# Altium project S12642_0404_etap3.PrjPcb
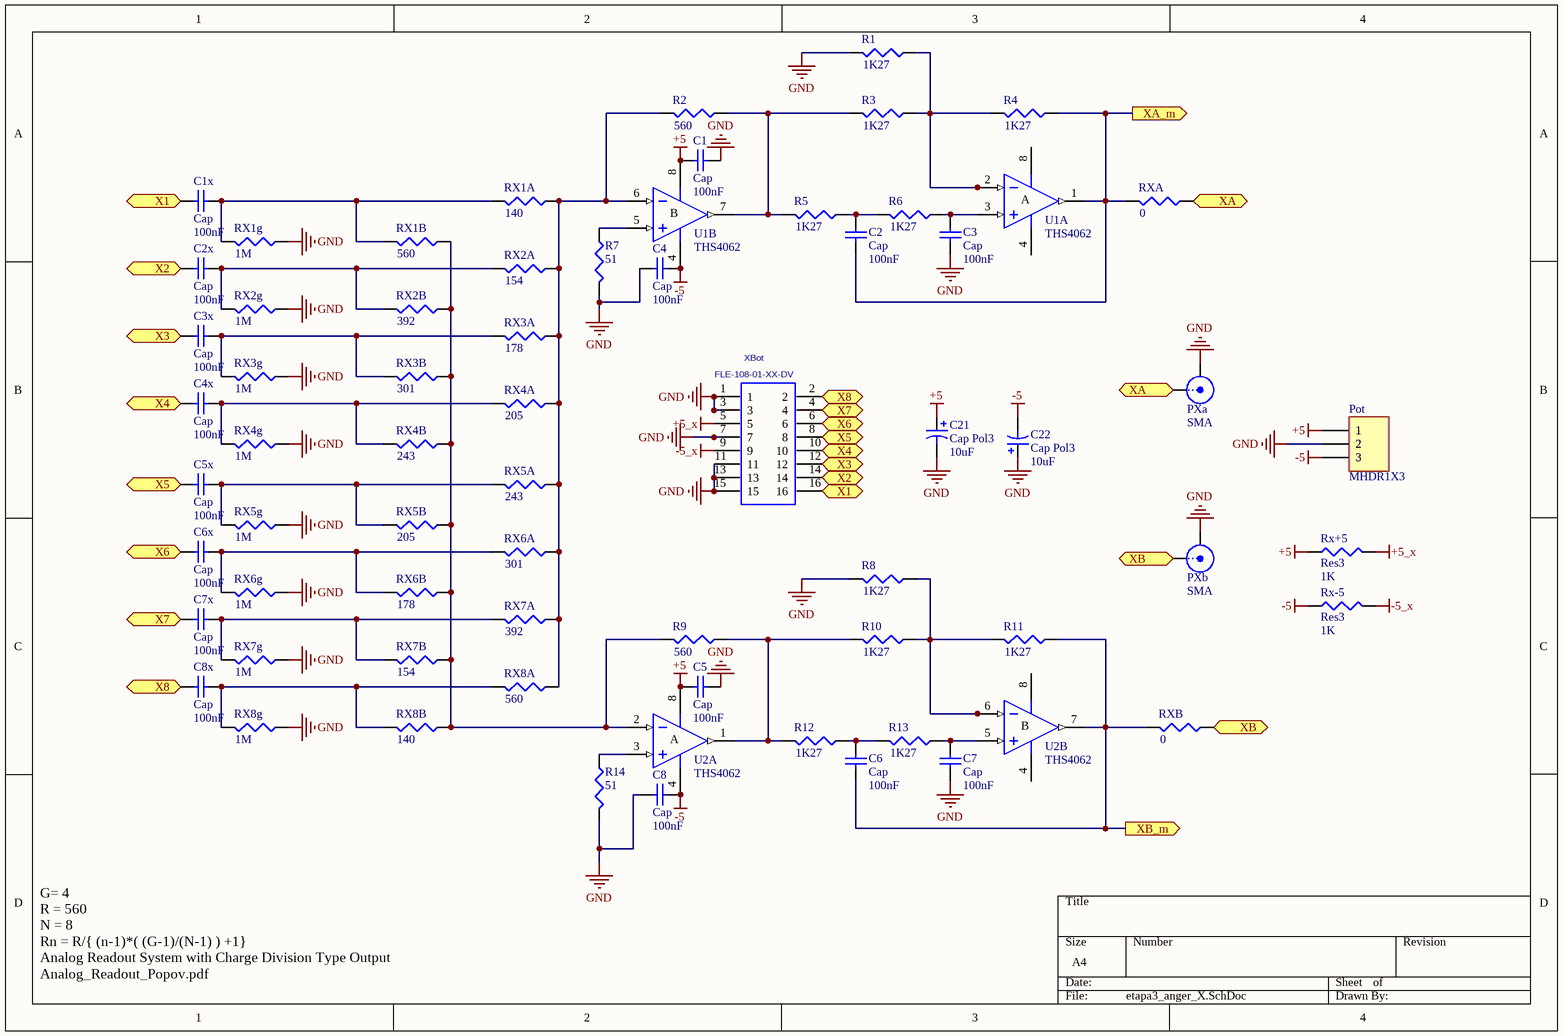
[diagram p0: etapa3_anger_X.SchDoc]
2 sheets, 129 parts. Net scope: flat (ports and power ports of the same name join across sheets).
Board file: etapa_3.PcbDoc
Sheets:
  etapa3_anger_X.SchDoc
  etapa3_anger_Y.SchDoc

## Sheet etapa3_anger_X.SchDoc
size A4

### Parts
C1  Cap  value 100nF  [0402]
C1x  Cap  value 100nF  [0402]
C2  Cap  value 100nF  [0402]
C2x  Cap  value 100nF  [0402]
C3  Cap  value 100nF  [0402]
C3x  Cap  value 100nF  [0402]
C4  Cap  value 100nF  [0402]
C4x  Cap  value 100nF  [0402]
C5  Cap  value 100nF  [0402]
C5x  Cap  value 100nF  [0402]
C6  Cap  value 100nF  [0402]
C6x  Cap  value 100nF  [0402]
C7  Cap  value 100nF  [0402]
C7x  Cap  value 100nF  [0402]
C8  Cap  value 100nF  [0402]
C8x  Cap  value 100nF  [0402]
C21  Cap Pol3  value 10uF  [1608[0603]]
C22  Cap Pol3  value 10uF  [1608[0603]]
Pot  MHDR1X3  [MHDR1X3]
PXa  SMA  [SMB_V-RJ45]
PXb  SMA  [SMB_V-RJ45]
R1  value 1K27  [0402]  (hidden comment: Res3)
R2  value 560  [0402]  (hidden comment: Res3)
R3  value 1K27  [0402]  (hidden comment: Res3)
R4  value 1K27  [0402]  (hidden comment: Res3)
R5  value 1K27  [0402]  (hidden comment: Res3)
R6  value 1K27  [0402]  (hidden comment: Res3)
R7  value 51  [0402]  (hidden comment: Res3)
R8  value 1K27  [0402]  (hidden comment: Res3)
R9  value 560  [0402]  (hidden comment: Res3)
R10  value 1K27  [0402]  (hidden comment: Res3)
R11  value 1K27  [0402]  (hidden comment: Res3)
R12  value 1K27  [0402]  (hidden comment: Res3)
R13  value 1K27  [0402]  (hidden comment: Res3)
R14  value 51  [0402]  (hidden comment: Res3)
RX1A  value 140  [0402]  (hidden comment: Res3)
RX1B  value 560  [0402]  (hidden comment: Res3)
RX1g  value 1M  [0402]  (hidden comment: Res3)
RX2A  value 154  [0402]  (hidden comment: Res3)
RX2B  value 392  [0402]  (hidden comment: Res3)
RX2g  value 1M  [0402]  (hidden comment: Res3)
RX3A  value 178  [0402]  (hidden comment: Res3)
RX3B  value 301  [0402]  (hidden comment: Res3)
RX3g  value 1M  [0402]  (hidden comment: Res3)
RX4A  value 205  [0402]  (hidden comment: Res3)
RX4B  value 243  [0402]  (hidden comment: Res3)
RX4g  value 1M  [0402]  (hidden comment: Res3)
RX5A  value 243  [0402]  (hidden comment: Res3)
RX5B  value 205  [0402]  (hidden comment: Res3)
RX5g  value 1M  [0402]  (hidden comment: Res3)
RX6A  value 301  [0402]  (hidden comment: Res3)
RX6B  value 178  [0402]  (hidden comment: Res3)
RX6g  value 1M  [0402]  (hidden comment: Res3)
RX7A  value 392  [0402]  (hidden comment: Res3)
RX7B  value 154  [0402]  (hidden comment: Res3)
RX7g  value 1M  [0402]  (hidden comment: Res3)
RX8A  value 560  [0402]  (hidden comment: Res3)
RX8B  value 140  [0402]  (hidden comment: Res3)
RX8g  value 1M  [0402]  (hidden comment: Res3)
Rx+5  Res3  value 1K  [J1-0603]
Rx-5  Res3  value 1K  [J1-0603]
RXA  value 0  [0402]  (hidden comment: Res3)
RXB  value 0  [0402]  (hidden comment: Res3)
U1  THS4062  [SO-8_M]  (parts A,B of 2)
U2  THS4062  [SO-8_M]  (parts A,B of 2)
XBot  FLE-108-01-XX-DV  [FLE-108-01-XX-DV]

### Ports
X1 (out), X2 (out), X3 (out), X4 (out), X5 (out), X6 (out), X7 (out), X8 (out), XA (out), XA_m (out), XB (out), XB_m (out)

### Nets
+5: C1.1 C5.1 C21.1 Pot.1 Rx+5.1 U1.8(V+) U2.8(V+)
+5_x: Rx+5.2 XBot.5
-5: C4.2 C8.2 C22.2 Pot.3 Rx-5.1 U1.4(V-) U2.4(V-)
-5_x: Rx-5.2 XBot.9
GND: C1.2 C3.2 C4.1 C5.2 C7.2 C8.1 C21.2 C22.1 Pot.2 PXa.2(Y) PXb.2(Y) R1.2 R7.2 R8.2 R14.2 RX1g.1 RX2g.1 RX3g.1 RX4g.1 RX5g.1 RX6g.1 RX7g.1 RX8g.1 XBot.1 XBot.3 XBot.7 XBot.11 XBot.13 XBot.15
NetC1x_1: C1x.1 XBot.16 ; port X1
NetC1x_2: C1x.2 RX1A.2 RX1B.2 RX1g.2
NetC2_1: C2.1 R5.1 R6.2
NetC2_2: C2.2 R4.1 RXA.2 U1.1(OUT) ; port XA_m
NetC2x_1: C2x.1 XBot.14 ; port X2
NetC2x_2: C2x.2 RX2A.2 RX2B.2 RX2g.2
NetC3_1: C3.1 R6.1 U1.3(IN+)
NetC3x_1: C3x.1 XBot.12 ; port X3
NetC3x_2: C3x.2 RX3A.2 RX3B.2 RX3g.2
NetC4x_1: C4x.1 XBot.10 ; port X4
NetC4x_2: C4x.2 RX4A.2 RX4B.2 RX4g.2
NetC5x_1: C5x.1 XBot.8 ; port X5
NetC5x_2: C5x.2 RX5A.2 RX5B.2 RX5g.2
NetC6_1: C6.1 R12.1 R13.2
NetC6_2: C6.2 R11.1 RXB.2 U2.7(OUT) ; port XB_m
NetC6x_1: C6x.1 XBot.6 ; port X6
NetC6x_2: C6x.2 RX6A.2 RX6B.2 RX6g.2
NetC7_1: C7.1 R13.1 U2.5(IN+)
NetC7x_1: C7x.1 XBot.4 ; port X7
NetC7x_2: C7x.2 RX7A.2 RX7B.2 RX7g.2
NetC8x_1: C8x.1 XBot.2 ; port X8
NetC8x_2: C8x.2 RX8A.2 RX8B.2 RX8g.2
NetPXa_1: PXa.1(X) RXA.1 ; port XA
NetPXb_1: PXb.1(X) RXB.1 ; port XB
NetR1_1: R1.1 R3.1 R4.2 U1.2(IN-)
NetR2_1: R2.1 R3.2 R5.2 U1.7(OUT)
NetR2_2: R2.2 RX1A.1 RX2A.1 RX3A.1 RX4A.1 RX5A.1 RX6A.1 RX7A.1 RX8A.1 U1.6(IN-)
NetR7_1: R7.1 U1.5(IN+)
NetR8_1: R8.1 R10.1 R11.2 U2.6(IN-)
NetR9_1: R9.1 R10.2 R12.2 U2.1(OUT)
NetR9_2: R9.2 RX1B.1 RX2B.1 RX3B.1 RX4B.1 RX5B.1 RX6B.1 RX7B.1 RX8B.1 U2.2(IN-)
NetR14_1: R14.1 U2.3(IN+)

### Notes on the sheet
- G= 4
  R = 560
  N = 8
  Rn = R/{ (n-1)*( (G-1)/(N-1) ) +1}
  Analog Readout System with Charge Division Type Output
  Analog_Readout_Popov.pdf
- (in symbol AD8002AR, part A) A
- (in symbol AD8002AR, part B) B

### Library data of the parts
C1 C1x C2 C2x C3 C3x C4 C4x C5 C5x C6 C6x C7 C7x C8 C8x = Cap: Capacitor; Published: 8-Jun-2000; LatestRevisionDate: 17-Jul-2002; LatestRevisionNote: Re-released for DXP Platform.; PackageReference: RAD-0.3; Publisher: Altium Limited; PackageDescription: Radial Cap, Thru-Hole; 2 Leads; 0.3 in Pin Spacing
C21 C22 = Cap Pol3: Polarized Capacitor (Surface Mount); Published: 8-Jun-2000; LatestRevisionDate: 29-May-2009; LatestRevisionNote: IPC-7351 Footprint Added.; PackageReference: C0805; Publisher: Altium Limited; PackageDescription: Chip Capacitor
Pot = MHDR1X3: Header, 3-Pin; LatestRevisionDate: 17-Jul-2002; LatestRevisionNote: Re-released for DXP Platform.; Publisher: Altium Limited
PXa PXb = SMB: SMB Straight Connector; LatestRevisionDate: 17-Jul-2002; LatestRevisionNote: Re-released for DXP Platform.; Publisher: Altium Limited
R1-R14 RX1A RX1B RX1g RX2A RX2B RX2g RX3A RX3B RX3g RX4A RX4B RX4g RX5A RX5B RX5g RX6A RX6B RX6g RX7A RX7B RX7g RX8A RX8B RX8g Rx+5 Rx-5 RXA RXB = Res3: Resistor; Published: 8-Jun-2000; LatestRevisionDate: 29-May-2009; LatestRevisionNote: IPC-7351 Footprint Added.; PackageReference: J1-0603; Publisher: Altium Limited; PackageDescription: Chip Resistor
U1 U2 = AD8002AR: Dual 600MHz, 50mW Current Feedback Amplifier; Published: 8-Jun-2000; LatestRevisionDate: 13-Apr-2006; LatestRevisionNote: IPC-7351 Footprint Added.; DatasheetVersion: REV. C 1999; PackageVersion: revA; PackageReference: SO-8; Publisher: Altium Limited; PackageDescription: 8-Pin Small Outline Integrated Circuit 1.27 mm Pitch; Code_JEDEC: MS-012-AA; Code_IPC: SOIC127P600-8; ComponentLink1Description: Manufacturer Link; ComponentLink1URL: http://www.analog.com/en/prod/0,,759_786_AD8002%2C00.html; ComponentLink2Description: Datasheet; ComponentLink2URL: http://www.analog.com/UploadedFiles/Data_Sheets/147523773AD8002_d.pdf
XBot = FLE-108-01-XX-DV: DUAL ROW 0.050'' STRIP ASSEMBLY.; MANUFACTURER: SAMTEC; CREATED: December 2, 2014 - Wendy Xin; PCB DECAL: FLE-108-01-XX-DV

## Sheet etapa3_anger_Y.SchDoc
size A4
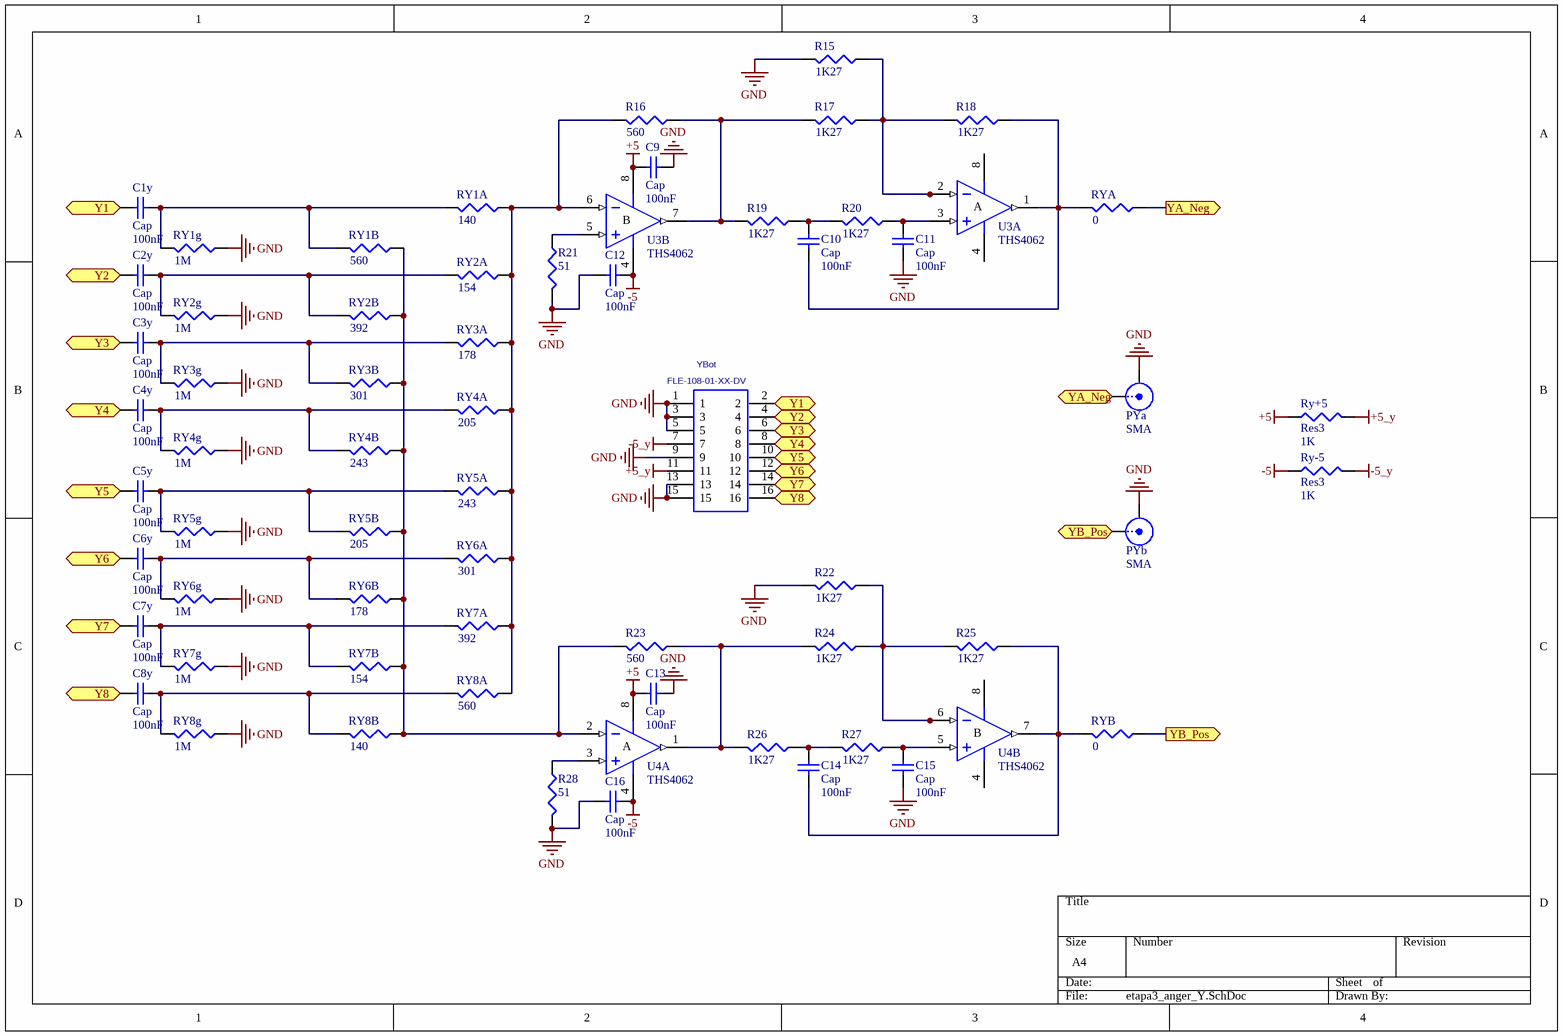
[diagram p1: etapa3_anger_Y.SchDoc]

### Parts
C1y  Cap  value 100nF  [0402]
C2y  Cap  value 100nF  [0402]
C3y  Cap  value 100nF  [0402]
C4y  Cap  value 100nF  [0402]
C5y  Cap  value 100nF  [0402]
C6y  Cap  value 100nF  [0402]
C7y  Cap  value 100nF  [0402]
C8y  Cap  value 100nF  [0402]
C9  Cap  value 100nF  [0402]
C10  Cap  value 100nF  [0402]
C11  Cap  value 100nF  [0402]
C12  Cap  value 100nF  [0402]
C13  Cap  value 100nF  [0402]
C14  Cap  value 100nF  [0402]
C15  Cap  value 100nF  [0402]
C16  Cap  value 100nF  [0402]
PYa  SMA  [SMB_V-RJ45]
PYb  SMA  [SMB_V-RJ45]
R15  value 1K27  [0402]  (hidden comment: Res3)
R16  value 560  [0402]  (hidden comment: Res3)
R17  value 1K27  [0402]  (hidden comment: Res3)
R18  value 1K27  [0402]  (hidden comment: Res3)
R19  value 1K27  [0402]  (hidden comment: Res3)
R20  value 1K27  [0402]  (hidden comment: Res3)
R21  value 51  [0402]  (hidden comment: Res3)
R22  value 1K27  [0402]  (hidden comment: Res3)
R23  value 560  [0402]  (hidden comment: Res3)
R24  value 1K27  [0402]  (hidden comment: Res3)
R25  value 1K27  [0402]  (hidden comment: Res3)
R26  value 1K27  [0402]  (hidden comment: Res3)
R27  value 1K27  [0402]  (hidden comment: Res3)
R28  value 51  [0402]  (hidden comment: Res3)
RY1A  value 140  [0402]  (hidden comment: Res3)
RY1B  value 560  [0402]  (hidden comment: Res3)
RY1g  value 1M  [0402]  (hidden comment: Res3)
RY2A  value 154  [0402]  (hidden comment: Res3)
RY2B  value 392  [0402]  (hidden comment: Res3)
RY2g  value 1M  [0402]  (hidden comment: Res3)
RY3A  value 178  [0402]  (hidden comment: Res3)
RY3B  value 301  [0402]  (hidden comment: Res3)
RY3g  value 1M  [0402]  (hidden comment: Res3)
RY4A  value 205  [0402]  (hidden comment: Res3)
RY4B  value 243  [0402]  (hidden comment: Res3)
RY4g  value 1M  [0402]  (hidden comment: Res3)
RY5A  value 243  [0402]  (hidden comment: Res3)
RY5B  value 205  [0402]  (hidden comment: Res3)
RY5g  value 1M  [0402]  (hidden comment: Res3)
RY6A  value 301  [0402]  (hidden comment: Res3)
RY6B  value 178  [0402]  (hidden comment: Res3)
RY6g  value 1M  [0402]  (hidden comment: Res3)
RY7A  value 392  [0402]  (hidden comment: Res3)
RY7B  value 154  [0402]  (hidden comment: Res3)
RY7g  value 1M  [0402]  (hidden comment: Res3)
RY8A  value 560  [0402]  (hidden comment: Res3)
RY8B  value 140  [0402]  (hidden comment: Res3)
RY8g  value 1M  [0402]  (hidden comment: Res3)
Ry+5  Res3  value 1K  [J1-0603]
Ry-5  Res3  value 1K  [J1-0603]
RYA  value 0  [0402]  (hidden comment: Res3)
RYB  value 0  [0402]  (hidden comment: Res3)
U3  THS4062  [SO-8_M]  (parts A,B of 2)
U4  THS4062  [SO-8_M]  (parts A,B of 2)
YBot  FLE-108-01-XX-DV  [FLE-108-01-XX-DV]

### Ports
Y1 (out), Y2 (out), Y3 (out), Y4 (out), Y5 (out), Y6 (out), Y7 (out), Y8 (out), YA_Neg (out), YB_Pos (out)

### Nets
+5: C9.1 C13.1 Ry+5.1 U3.8(V+) U4.8(V+)
+5_y: Ry+5.2 YBot.11
-5: C12.2 C16.2 Ry-5.1 U3.4(V-) U4.4(V-)
-5_y: Ry-5.2 YBot.7
GND: C9.2 C11.2 C12.1 C13.2 C15.2 C16.1 PYa.2(Y) PYb.2(Y) R15.2 R21.2 R22.2 R28.2 RY1g.1 RY2g.1 RY3g.1 RY4g.1 RY5g.1 RY6g.1 RY7g.1 RY8g.1 YBot.1 YBot.3 YBot.5 YBot.9 YBot.13 YBot.15
NetC1y_1: C1y.1 YBot.2 ; port Y1
NetC1y_2: C1y.2 RY1A.2 RY1B.2 RY1g.2
NetC2y_1: C2y.1 YBot.4 ; port Y2
NetC2y_2: C2y.2 RY2A.2 RY2B.2 RY2g.2
NetC3y_1: C3y.1 YBot.6 ; port Y3
NetC3y_2: C3y.2 RY3A.2 RY3B.2 RY3g.2
NetC4y_1: C4y.1 YBot.8 ; port Y4
NetC4y_2: C4y.2 RY4A.2 RY4B.2 RY4g.2
NetC5y_1: C5y.1 YBot.10 ; port Y5
NetC5y_2: C5y.2 RY5A.2 RY5B.2 RY5g.2
NetC6y_1: C6y.1 YBot.12 ; port Y6
NetC6y_2: C6y.2 RY6A.2 RY6B.2 RY6g.2
NetC7y_1: C7y.1 YBot.14 ; port Y7
NetC7y_2: C7y.2 RY7A.2 RY7B.2 RY7g.2
NetC8y_1: C8y.1 YBot.16 ; port Y8
NetC8y_2: C8y.2 RY8A.2 RY8B.2 RY8g.2
NetC10_1: C10.1 R19.1 R20.2
NetC10_2: C10.2 R18.1 RYA.2 U3.1(OUT)
NetC11_1: C11.1 R20.1 U3.3(IN+)
NetC14_1: C14.1 R26.1 R27.2
NetC14_2: C14.2 R25.1 RYB.2 U4.7(OUT)
NetC15_1: C15.1 R27.1 U4.5(IN+)
NetPYa_1: PYa.1(X) RYA.1 ; port YA_Neg
NetPYb_1: PYb.1(X) RYB.1 ; port YB_Pos
NetR15_1: R15.1 R17.1 R18.2 U3.2(IN-)
NetR16_1: R16.1 R17.2 R19.2 U3.7(OUT)
NetR16_2: R16.2 RY1A.1 RY2A.1 RY3A.1 RY4A.1 RY5A.1 RY6A.1 RY7A.1 RY8A.1 U3.6(IN-)
NetR21_1: R21.1 U3.5(IN+)
NetR22_1: R22.1 R24.1 R25.2 U4.6(IN-)
NetR23_1: R23.1 R24.2 R26.2 U4.1(OUT)
NetR23_2: R23.2 RY1B.1 RY2B.1 RY3B.1 RY4B.1 RY5B.1 RY6B.1 RY7B.1 RY8B.1 U4.2(IN-)
NetR28_1: R28.1 U4.3(IN+)

### Notes on the sheet
- (in symbol AD8002AR, part A) A
- (in symbol AD8002AR, part B) B

### Library data of the parts
C1y C2y C3y C4y C5y C6y C7y C8y C9-C16 = Cap: Capacitor; Published: 8-Jun-2000; LatestRevisionDate: 17-Jul-2002; LatestRevisionNote: Re-released for DXP Platform.; PackageReference: RAD-0.3; Publisher: Altium Limited; PackageDescription: Radial Cap, Thru-Hole; 2 Leads; 0.3 in Pin Spacing
PYa PYb = SMB: SMB Straight Connector; LatestRevisionDate: 17-Jul-2002; LatestRevisionNote: Re-released for DXP Platform.; Publisher: Altium Limited
R15-R28 RY1A RY1B RY1g RY2A RY2B RY2g RY3A RY3B RY3g RY4A RY4B RY4g RY5A RY5B RY5g RY6A RY6B RY6g RY7A RY7B RY7g RY8A RY8B RY8g Ry+5 Ry-5 RYA RYB = Res3: Resistor; Published: 8-Jun-2000; LatestRevisionDate: 29-May-2009; LatestRevisionNote: IPC-7351 Footprint Added.; PackageReference: J1-0603; Publisher: Altium Limited; PackageDescription: Chip Resistor
U3 U4 = AD8002AR: as U1 on sheet etapa3_anger_X; Published: 8-Jun-2000; LatestRevisionDate: 13-Apr-2006; LatestRevisionNote: IPC-7351 Footprint Added.; DatasheetVersion: REV. C 1999; PackageVersion: revA; PackageReference: SO-8; Publisher: Altium Limited; PackageDescription: 8-Pin Small Outline Integrated Circuit 1.27 mm Pitch; Code_JEDEC: MS-012-AA; Code_IPC: SOIC127P600-8; ComponentLink1Description: Manufacturer Link; ComponentLink1URL: http://www.analog.com/en/prod/0,,759_786_AD8002%2C00.html; ComponentLink2Description: Datasheet; ComponentLink2URL: http://www.analog.com/UploadedFiles/Data_Sheets/147523773AD8002_d.pdf
YBot = FLE-108-01-XX-DV: as XBot on sheet etapa3_anger_X; CREATED: December 2, 2014 - Wendy Xin; PCB DECAL: FLE-108-01-XX-DV

## Nets that join several sheets
+5: etapa3_anger_X (7 pins), etapa3_anger_Y (5 pins)
-5: etapa3_anger_X (7 pins), etapa3_anger_Y (5 pins)
GND: etapa3_anger_X (29 pins), etapa3_anger_Y (26 pins)